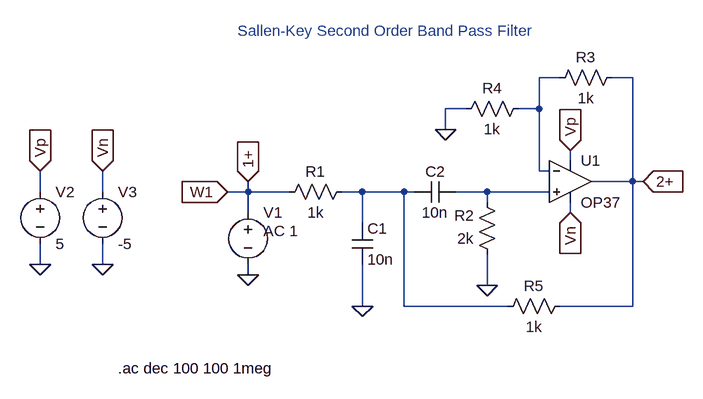
[diagram p0: schematic sk_bpf.asc]
sk_bpf.asc, the LTspice schematic file:
Version 4
SHEET 1 880 680
WIRE 464 -32 432 -32
WIRE 576 -32 544 -32
WIRE 320 16 288 16
WIRE 432 16 432 -32
WIRE 432 16 400 16
WIRE 288 48 288 16
WIRE 480 96 480 80
WIRE 432 112 432 16
WIRE 448 112 432 112
WIRE 576 128 576 -32
WIRE 576 128 512 128
WIRE 592 128 576 128
WIRE -336 144 -336 112
WIRE -240 144 -240 112
WIRE -16 144 -16 128
WIRE -16 144 -48 144
WIRE 48 144 -16 144
WIRE 160 144 128 144
WIRE 224 144 160 144
WIRE 240 144 224 144
WIRE 352 144 304 144
WIRE 448 144 352 144
WIRE 352 160 352 144
WIRE -16 176 -16 144
WIRE 480 176 480 160
WIRE 160 192 160 144
WIRE -336 256 -336 224
WIRE -240 256 -240 224
WIRE -16 272 -16 256
WIRE 352 288 352 240
WIRE 160 320 160 256
WIRE 224 320 224 144
WIRE 384 320 224 320
WIRE 576 320 576 128
WIRE 576 320 464 320
FLAG 480 80 Vp
IOPIN 480 80 In
FLAG 480 176 Vn
IOPIN 480 176 In
FLAG 592 128 2+
IOPIN 592 128 In
FLAG 288 48 0
FLAG -16 272 0
FLAG -48 144 W1
IOPIN -48 144 In
FLAG -16 128 1+
IOPIN -16 128 In
FLAG 352 288 0
FLAG -336 256 0
FLAG -240 256 0
FLAG -336 112 Vp
IOPIN -336 112 In
FLAG -240 112 Vn
IOPIN -240 112 In
FLAG 160 320 0
SYMBOL Opamps\\OP37 480 64 R0
SYMATTR InstName U1
SYMBOL res 560 -48 R90
WINDOW 0 0 56 VBottom 2
WINDOW 3 32 56 VTop 2
SYMATTR InstName R3
SYMATTR Value 1k
SYMBOL res 416 0 R90
WINDOW 0 0 56 VBottom 2
WINDOW 3 32 56 VTop 2
SYMATTR InstName R4
SYMATTR Value 1k
SYMBOL cap 144 192 R0
SYMATTR InstName C1
SYMATTR Value 10n
SYMBOL res 480 304 R90
WINDOW 0 0 56 VBottom 2
WINDOW 3 32 56 VTop 2
SYMATTR InstName R5
SYMATTR Value 1k
SYMBOL res 368 256 R180
WINDOW 0 36 76 Left 2
WINDOW 3 36 40 Left 2
SYMATTR InstName R2
SYMATTR Value 2k
SYMBOL voltage -16 160 R0
WINDOW 123 24 44 Left 2
WINDOW 39 0 0 Left 0
SYMATTR Value2 AC 1
SYMATTR InstName V1
SYMATTR Value ""
SYMBOL cap 304 128 R90
WINDOW 0 0 32 VBottom 2
WINDOW 3 32 32 VTop 2
SYMATTR InstName C2
SYMATTR Value 10n
SYMBOL voltage -336 128 R0
WINDOW 123 0 0 Left 0
WINDOW 39 0 0 Left 0
SYMATTR InstName V2
SYMATTR Value 5
SYMBOL voltage -240 128 R0
WINDOW 123 0 0 Left 0
WINDOW 39 0 0 Left 0
SYMATTR InstName V3
SYMATTR Value -5
SYMBOL res 144 128 R90
WINDOW 0 0 56 VBottom 2
WINDOW 3 32 56 VTop 2
SYMATTR InstName R1
SYMATTR Value 1k
TEXT -216 416 Left 2 !.ac dec 100 100 1meg
TEXT -32 -104 Left 2 ;Sallen-Key Second Order Band Pass Filter

The netlist it stands for:
* sk_bpf.asc
XU1 N003 N001 Vp Vn 2+ LT1037  ; OP37, pins In+ In- V+ V- OUT
R3 2+ N001 1k
R4 N001 0 1k
C1 N002 0 10n
R5 2+ N002 1k
R2 0 N003 2k
V1 1+ 0 AC 1
C2 N003 N002 10n
V2 Vp 0 5
V3 Vn 0 -5
R1 N002 1+ 1k
.ac dec 100 100 1meg
* Sallen-Key Second Order Band Pass Filter
.lib LTC.lib
.backanno
.end